# EAGLE design VocoreMotorShieldDRV8835 (EAGLE 6.5.0)
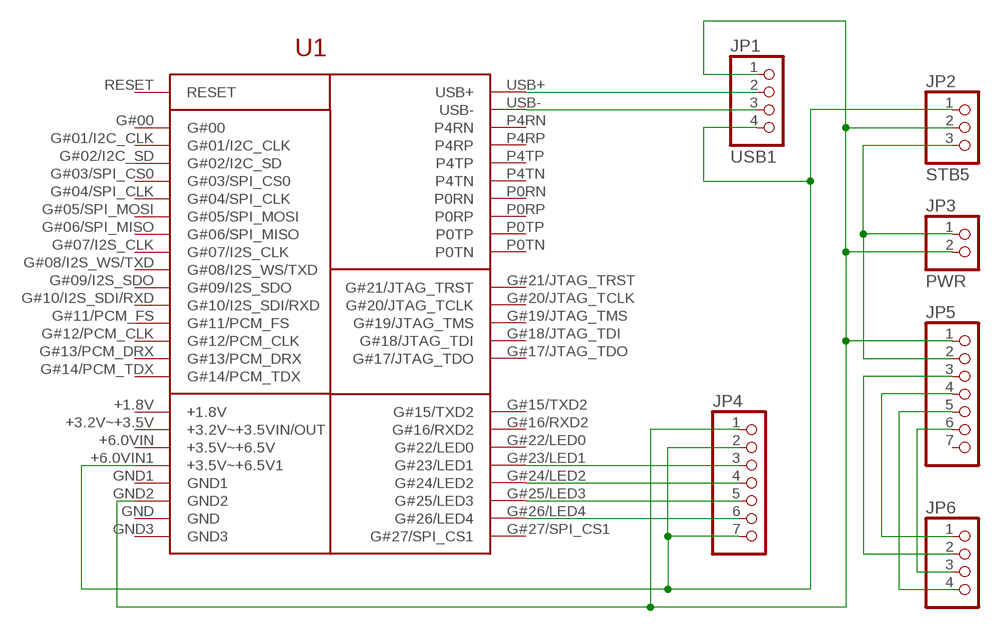
[diagram p0: schematic, sheet 1]

## Parts
JP1  USB1  PINHD-1X4  [1X04]
JP2  STB5  PINHD-1X3  [1X03]
JP3  PWR  PINHD-1X2  [1X02]
JP4  PINHD-1X7  [1X07]
JP5  PINHD-1X7  [1X07]
JP6  PINHD-1X4  [1X04]
U1  VOCORE_SHIELD  [VOCORE_DOC_CUSTOM]

## Nets
N$1: JP1.1 JP2.2 JP3.2 JP4.1 JP5.1 U1.GND2
N$2: JP2.3 JP3.1 JP5.2
N$3: JP1.4 JP2.1 JP4.2 JP4.7 U1.+6.0VIN1(+3.5V~+6.5V1)
N$4: JP4.3 U1.G#23/LED1
N$5: JP1.3 U1.USB-
N$6: JP1.2 U1.USB+
N$7: JP4.4 U1.G#24/LED2
N$8: JP4.5 U1.G#25/LED3
N$9: JP4.6 U1.G#26/LED4
N$10: JP5.4 JP6.1
N$11: JP5.3 JP6.2
N$13: JP5.5 JP6.4
N$14: JP5.6 JP6.3
Unconnected: JP5.7 U1.+1.8V U1.+3.2V~+3.5V(+3.2V~+3.5VIN/OUT) U1.+6.0VIN(+3.5V~+6.5V) U1.G#00 U1.G#01/I2C_CLK U1.G#02/I2C_SD U1.G#03/SPI_CS0 U1.G#04/SPI_CLK U1.G#05/SPI_MOSI U1.G#06/SPI_MISO U1.G#07/I2S_CLK U1.G#08/I2S_WS/TXD U1.G#09/I2S_SDO U1.G#10/I2S_SDI/RXD U1.G#11/PCM_FS U1.G#12/PCM_CLK U1.G#13/PCM_DRX U1.G#14/PCM_TDX U1.G#15/TXD2 U1.G#16/RXD2 U1.G#17/JTAG_TDO U1.G#18/JTAG_TDI U1.G#19/JTAG_TMS U1.G#20/JTAG_TCLK U1.G#21/JTAG_TRST U1.G#22/LED0 U1.G#27/SPI_CS1 U1.GND U1.GND1 U1.GND3 U1.P0RN U1.P0RP U1.P0TN U1.P0TP U1.P4RN U1.P4RP U1.P4TN U1.P4TP U1.RESET

## Library data of the parts
JP1 JP6 = pinhead:PINHD-1X4: PIN HEADER
JP2 = pinhead:PINHD-1X3: PIN HEADER
JP3 = pinhead:PINHD-1X2: PIN HEADER
JP4 JP5 = pinhead:PINHD-1X7: PIN HEADER
U1 = Vocore:VOCORE_SHIELD

## Board
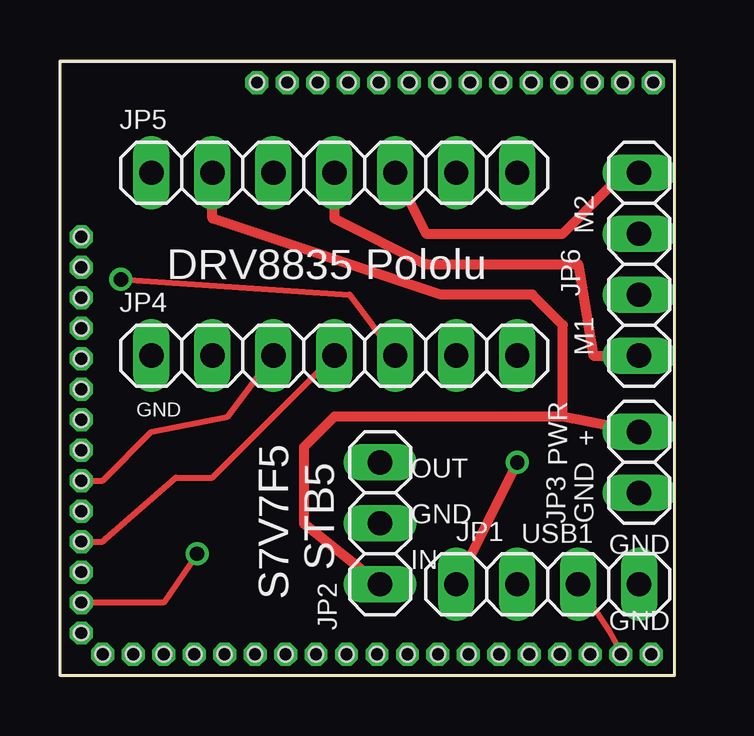
[diagram p1: board, top side]
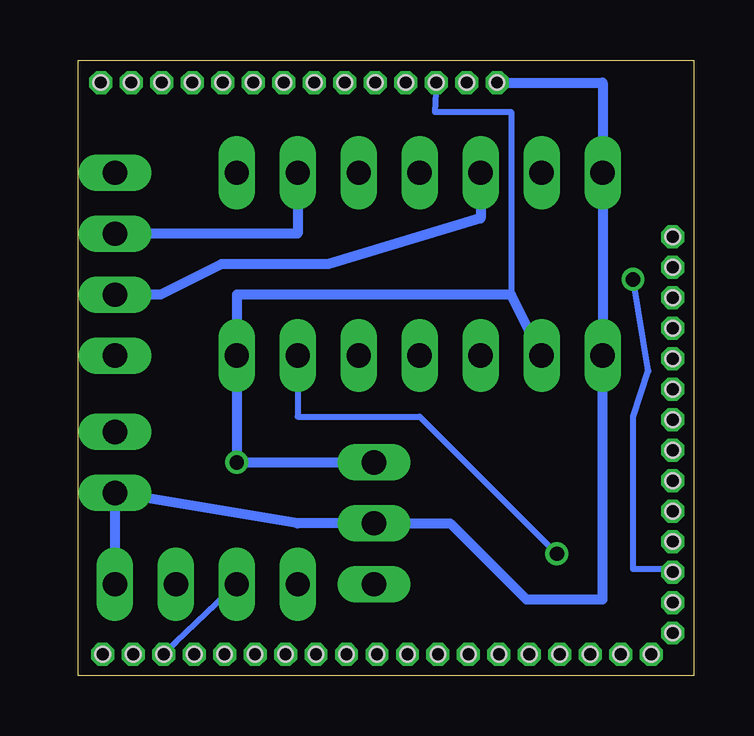
[diagram p2: board, bottom side, seen from below]

Size 25.65 x 25.65 mm. Coordinates in mm from the lower left corner, seen from the top.
Outline: 0,0 25.65,0 25.65,25.65 0,25.65 0,0
Copper layers (1*16): Top 0.0356mm / dielectric 1.5011mm / Bottom 0.0356mm
Design rules "LaenPCBOrder": minimum track width 6mil, minimum drill 13mil, track to track 6mil, track to pad 6mil, pad to pad 6mil, via to via 6mil, smd to smd 6mil, copper to edge 15mil, drill to drill 6mil, minimum pad ring 7mil, minimum via ring 7mil, stop-mask expansion 3mil, vias tented up to drill 0mil, thermal gap 10mil

### Footprints (pad centres in the part's own frame; a part is rotated, then mirrored left to right if it is on the bottom)
1X04 = drill 1.016 long: 1 -3.81,0; 2 -1.27,0; 3 1.27,0; 4 3.81,0
1X03 = drill 1.016 long: 1 -2.54,0; 2 0,0; 3 2.54,0
1X02 = drill 1.016 long: 1 -1.27,0; 2 1.27,0
1X07 = drill 1.016 long: 1 -7.62,0; 2 -5.08,0; 3 -2.54,0; 4 0,0; 5 2.54,0; 6 5.08,0; 7 7.62,0
VOCORE_DOC_CUSTOM = drill 0.6 pad 0.889 octagon: +1.8V 0.889,13.208; +3.2V~+3.5V 24.638,0.889; +6.0VIN 9.474,24.714; +6.0VIN1 10.744,24.714; G#00 18.364,24.714; G#01/I2C_CLK 20.904,24.714; G#02/I2C_SD 22.174,24.714; G#03/SPI_CS0 9.398,0.889; G#04/SPI_CLK 0.889,11.938; G#05/SPI_MOSI 0.889,10.668; G#06/SPI_MISO 8.128,0.889; G#07/I2S_CLK 4.318,0.889; G#08/I2S_WS/TXD 0.889,14.478; G#09/I2S_SDO 0.889,17.018; G#10/I2S_SDI/RXD 6.858,0.889; G#11/PCM_FS 10.668,0.889; G#12/PCM_CLK 0.889,18.288; G#13/PCM_DRX 0.889,6.858; G#14/PCM_TDX 0.889,1.778; G#15/TXD2 3.048,0.889; G#16/RXD2 5.588,0.889; G#17/JTAG_TDO 13.284,24.714; G#18/JTAG_TDI 19.634,24.714; G#19/JTAG_TMS 17.094,24.714; G#20/JTAG_TCLK 15.824,24.714; G#21/JTAG_TRST 14.554,24.714; G#22/LED0 0.889,15.748; G#23/LED1 0.889,8.128; G#24/LED2 0.889,5.588; G#25/LED3 0.889,4.318; G#26/LED4 0.889,3.048; G#27/SPI_CS1 0.889,9.398; GND 24.714,24.714; GND1 12.014,24.714; GND2 8.204,24.714; GND3 1.778,0.889; P0RN 15.748,0.889; P0RP 14.478,0.889; P0TN 11.938,0.889; P0TP 13.208,0.889; P4RN 20.828,0.889; P4RP 19.558,0.889; P4TN 17.018,0.889; P4TP 18.288,0.889; RESET 23.444,24.714; USB+ 23.368,0.889; USB- 22.098,0.889 | hole 0.6: 0.889,1.778; 0.889,3.048; 0.889,4.318; 0.889,5.588; 0.889,6.858; 0.889,8.128; 0.889,9.398; 0.889,10.668; 0.889,11.938; 0.889,13.208; 0.889,14.478; 0.889,15.748; 0.889,17.018; 0.889,18.288; 8.204,24.714; 24.714,24.714; 23.444,24.714; 22.174,24.714; 20.904,24.714; 19.634,24.714; 18.364,24.714; 17.094,24.714; 15.824,24.714; 14.554,24.714; 13.284,24.714; 12.014,24.714; 10.744,24.714; 9.474,24.714; 1.778,0.889; 18.288,0.889; 17.018,0.889; 15.748,0.889; 14.478,0.889; 13.208,0.889; 11.938,0.889; 10.668,0.889; 9.398,0.889; 8.128,0.889; 6.858,0.889; 5.588,0.889; 4.318,0.889; 3.048,0.889; 24.638,0.889; 23.368,0.889; 22.098,0.889; 20.828,0.889; 19.558,0.889

### Placement (x,y rotation side)
JP1  20.32,3.81 180 top
JP2  13.34,6.35 270 top
JP3  24.13,8.89 270 top
JP4  11.43,13.34 0 top
JP5  11.43,20.95 0 top
JP6  24.13,17.14 90 top
U1  0,0 0 top

### Tracks (layer width: path | path; a pad name or v marks a point on that pad's centre or on a via)
N$1  (via drill 0.6)
  Bottom 0.406: JP1.1 JP3.2 16.51,6.35 JP2.2 10.16,6.35 6.99,3.17 3.81,3.17 JP4.1 JP5.1 3.81,24.71 U1.GND2
  other vias: 24.13,3.81
N$2
  Top 0.406: JP2.3 10.16,6.35 10.16,9.53 11.43,10.79 20.95,10.79 | JP3.1 20.95,10.79 | 20.95,10.79 20.95,14.61 19.68,15.88 15.88,15.88 6.35,19.05 JP5.2
N$3  (via drill 0.6)
  Top 0.406: v19.05,8.89 JP1.4
  Bottom 0.254: U1.+6.0VIN1 10.79,23.5 7.62,23.5 7.62,15.88
  Bottom 0.406: JP4.2 7.62,15.88 19.05,15.88 JP4.7 v19.05,8.89 JP2.1
N$4
  Top 0.254: U1.G#23/LED1 1.78,8.13 3.81,10.16 6.99,10.79 JP4.3
N$5
  Bottom 0.254: U1.USB- 21.59,1.4 JP1.3
N$6
  Top 0.254: U1.USB+ 23.5,0.76 22.86,1.91 JP1.2
N$7
  Top 0.254: U1.G#24/LED2 1.78,5.59 1.91,5.71 4.83,8.26 6.35,8.26 JP4.4
N$8  (via drill 0.6)
  Top 0.254: v2.54,16.51 12.06,15.88 JP4.5
  Bottom 0.254: U1.G#25/LED3 1.02,4.45 2.54,4.45 2.54,10.79 1.91,12.7 v2.54,16.51
N$9  (via drill 0.6)
  Top 0.254: v5.71,5.08 4.32,3.05 U1.G#26/LED4
  Bottom 0.254: JP4.6 16.51,10.79 11.43,10.79 v5.71,5.08
N$10
  Top 0.406: JP6.1 22.23,13.34 21.59,17.14 15.24,17.14 11.43,19.05 JP5.4
N$11
  Bottom 0.406: JP5.3 8.89,19.05 15.24,17.14 19.68,17.14 22.23,15.88 JP6.2
N$13
  Top 0.305: 23.5,20.95 JP6.4
  Top 0.406: JP5.5 15.24,18.41 20.95,18.41 23.5,20.95
N$14
  Bottom 0.406: JP6.3 16.51,18.41 JP5.6

### Text on the board
tNames: M2 | DRV8835 Pololu | M1 | GND | + | OUT | GND | GND | GND | IN | S7V7F5 | GND